# EasyEDA Pro project ProPrj_Joystick_2025-05-01.epro

# Schematic Joystick
Board Name: Joystick; Create Date: 2025-05-01; Page Name: Sheet_1; Project Name: Joystick; Schematic Name: Joystick; Update Date: 2025-05-01; Add into BOM: yes; Company: Your Company; Convert to PCB: yes; Date: 2023-04-02; Draw By: azamtau; REV: 1.0; Sheet: 1/1; spicePre: .
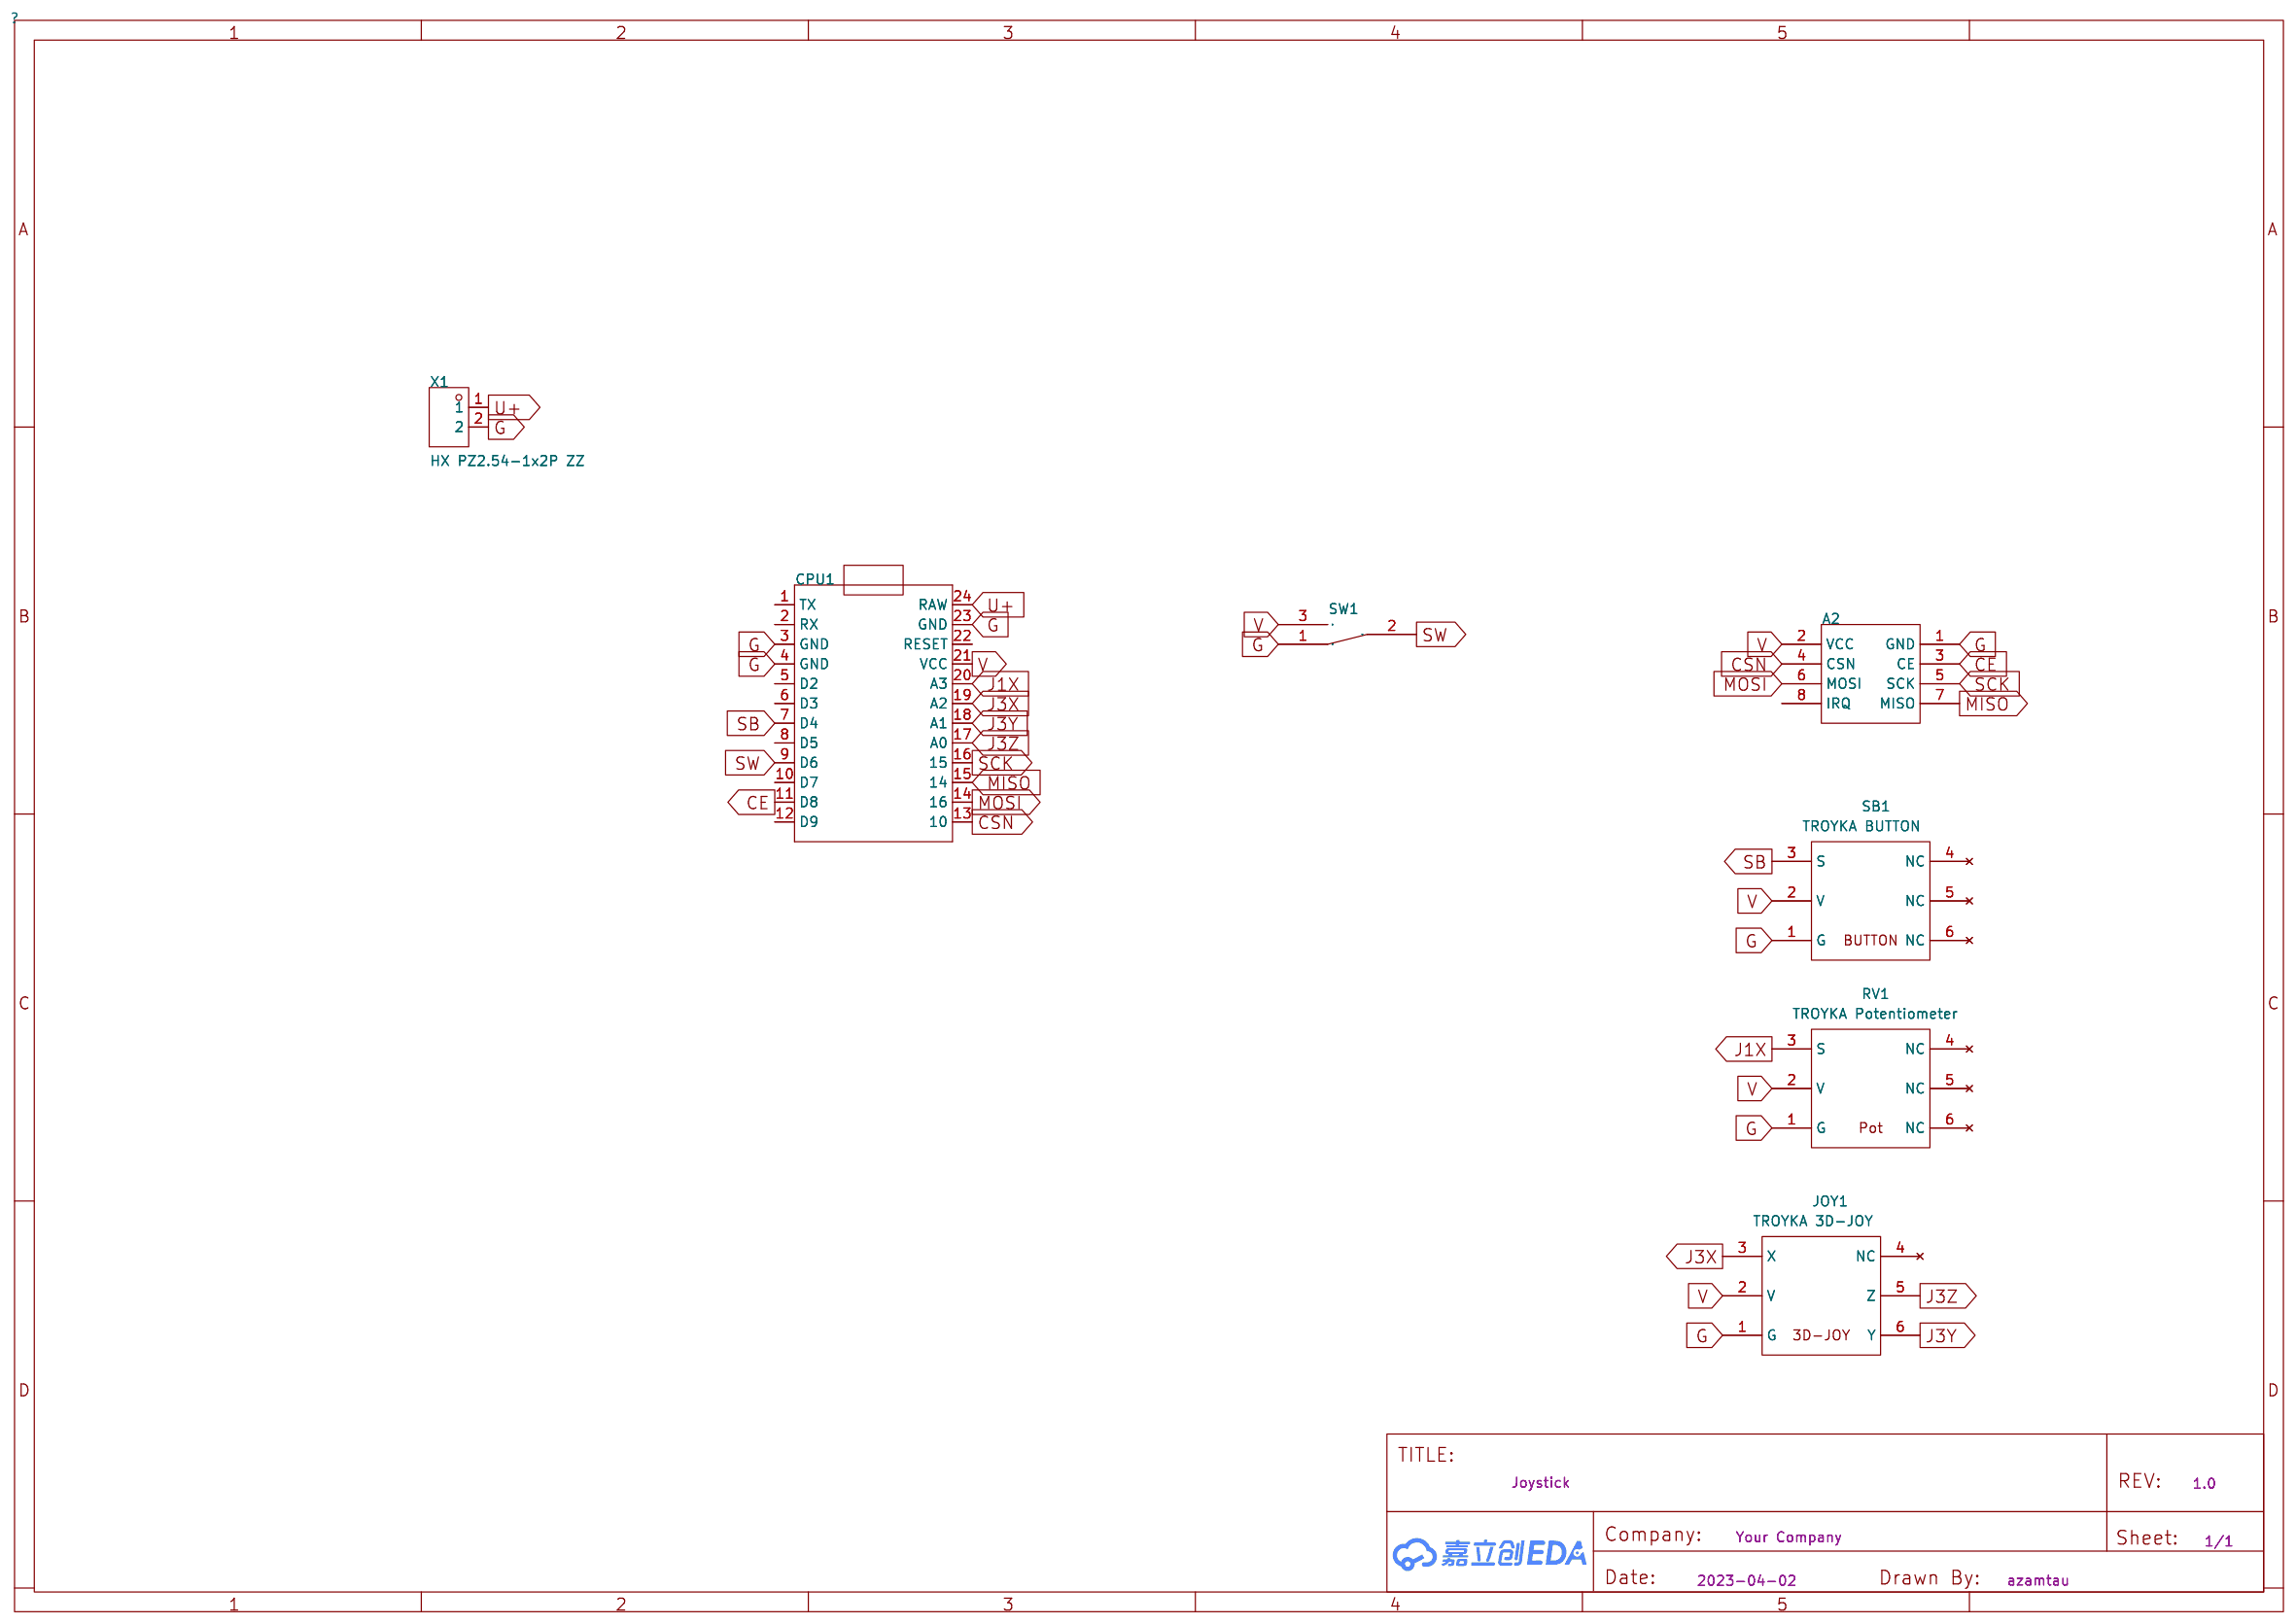
[diagram p0: schematic sheet]

## Parts
A2  -  [MODULE, NRF24L01+]
CPU1  -  [ARDUINOPROMICROUSB]
JOY1  TROYKA 3D-JOY  [TROYKA 3D-JOY]
RV1  TROYKA Potentiometer  [TROYKA Potentiometer]
SB1  TROYKA BUTTON  [TROYKA BUTTON]
SW1  ST-0-102-A01-T000-LF  [SW-TH_3P-L8.3-W5.2-P2.54_ST-0-102-A01-T000]
X1  HX PZ2.54-1x2P ZZ  [HDR-TH_2P-P2.54-V-M-3]

## Library data of the parts
A2 = MODULE, NRF24L01+
CPU1 = Arduino Pro Micro: Arduino Pro Micro с Micro USB (ATmega32U4 5v); NO_CONNECT: yes
JOY1 = TROYKA 3D-JOY
RV1 = TROYKA Potentiometer
SB1 = TROYKA BUTTON
SW1 = ST-0-102-A01-T000-LF: Circuit:Single Pole Double Throw (SPDT) Switch Length:8.3mm Switch Width:5.2mm Switch Height:23.6mm Mechanical Life:- Contact Current:3A Voltage Rating (AC):125V Actuator Type:Cylinder knob Pin Style:Solder Mounting Style:Direct Insert Operating Temperatu; LCSC Part Name: 超小型钮子三脚二档 五件套 含配件; Supplier Part: C1788487; Manufacturer: YUEN FUNG(源丰); Supplier Footprint: 插件; JLCPCB Part Class: Extended Part; Datasheet: https://atta.szlcsc.com/upload/public/pdf/source/20230720/31DDFEC61AC21D005BE18E754C3E93F0.pdf; Supplier: LCSC; Circuit: Single Pole Double Throw (SPDT); Switch Length: 8.3mm; Switch Width: 5.2mm; Switch Height: 23.6mm; Contact Current: 3A; Voltage Rating (AC): 125V; Actuator Type: Cylinder knob; Pin Style: Solder; Mounting Style: Direct Insert; Operating Temperature: -25℃~+85℃
X1 = HX PZ2.54-1x2P ZZ: Pin Structure:1x2P Pitch:2.54mm Row Spacing:- Circluar Pins/Square Pins:Policy Mounting Type:Straight Number of Rows:Single Row Number of Pins:2P Current Rating:3A Voltage Rating (Max):- Length of Mating Pin:6mm Insulation Height:2.5mm Length of End Conne; LCSC Part Name: 1x2P 间距:2.54mm 方针 直插; Supplier Part: C32713268; Manufacturer: hanxia(韩下); Supplier Footprint: 插件,P=2.54mm; JLCPCB Part Class: Extended Part; Datasheet: https://atta.szlcsc.com/upload/public/pdf/source/20240723/BA527AFD31224C91BCCA61696687E4B6.pdf; Supplier: LCSC; Pin Structure: 1x2P; Pitch: 2.54mm; Circluar Pins/Square Pins: Policy; Mounting Type: Straight; Number of Rows: Single Row; Number of Pins: 2P; Current Rating: 3A; Length of Mating Pin: 6mm; Insulation Height: 2.5mm; Length of End Connection Pin: 3mm; Contact Material: Brass; Contact Plating: Gold; Operating Temperature: -40℃~+105℃; Color: Black

## Nets
CE: A2.3(CE) CPU1.11(D8)
CSN: A2.4(CSN) CPU1.13(10)
G: A2.1(GND) CPU1.3(GND) CPU1.4(GND) CPU1.23(GND) JOY1.1(G) RV1.1(G) SB1.1(G) SW1.1 X1.2
J1X: CPU1.20(A3) RV1.3(S)
J3X: CPU1.19(A2) JOY1.3(X)
J3Y: CPU1.18(A1) JOY1.6(Y)
J3Z: CPU1.17(A0) JOY1.5(Z)
MISO: A2.7(MISO) CPU1.15(14)
MOSI: A2.6(MOSI) CPU1.14(16)
SB: CPU1.7(D4) SB1.3(S)
SCK: A2.5(SCK) CPU1.16(15)
SW: CPU1.9(D6) SW1.2
U+: CPU1.24(RAW) X1.1
V: A2.2(VCC) CPU1.21(VCC) JOY1.2(V) RV1.2(V) SB1.2(V) SW1.3

Not connected (* = marked no-connect by the designer): A2 8(IRQ); CPU1 1(TX) 2(RX) 5(D2) 6(D3) 8(D5) 10(D7) 12(D9) 22(RESET); JOY1 4(NC); RV1 4(NC) 5(NC) 6(NC); SB1 4(NC) 5(NC) 6(NC)

# Board PCB_Joystick
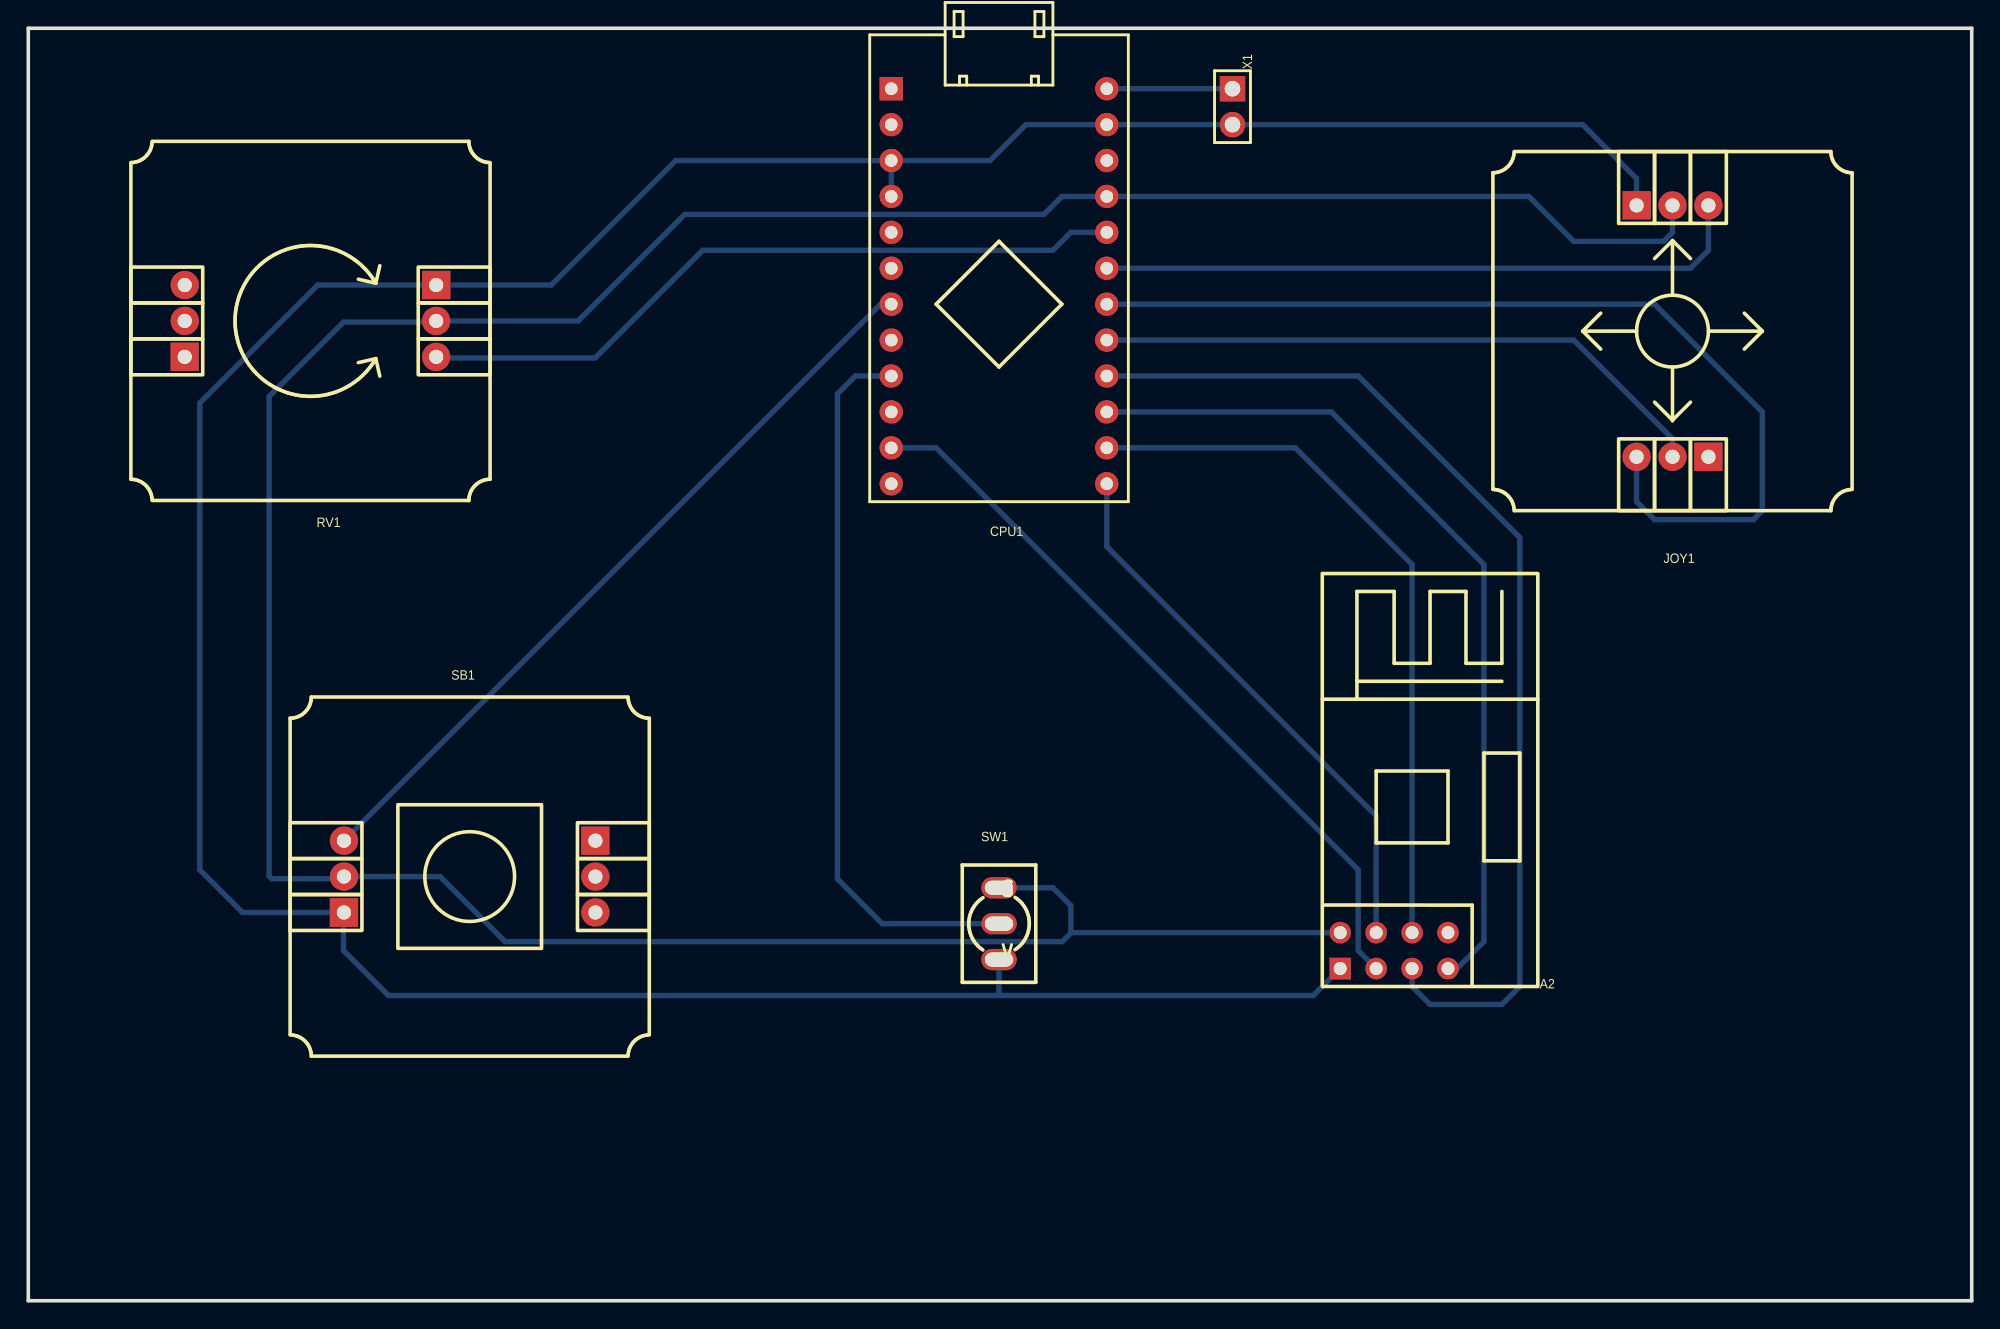
[diagram p1: board, top side]
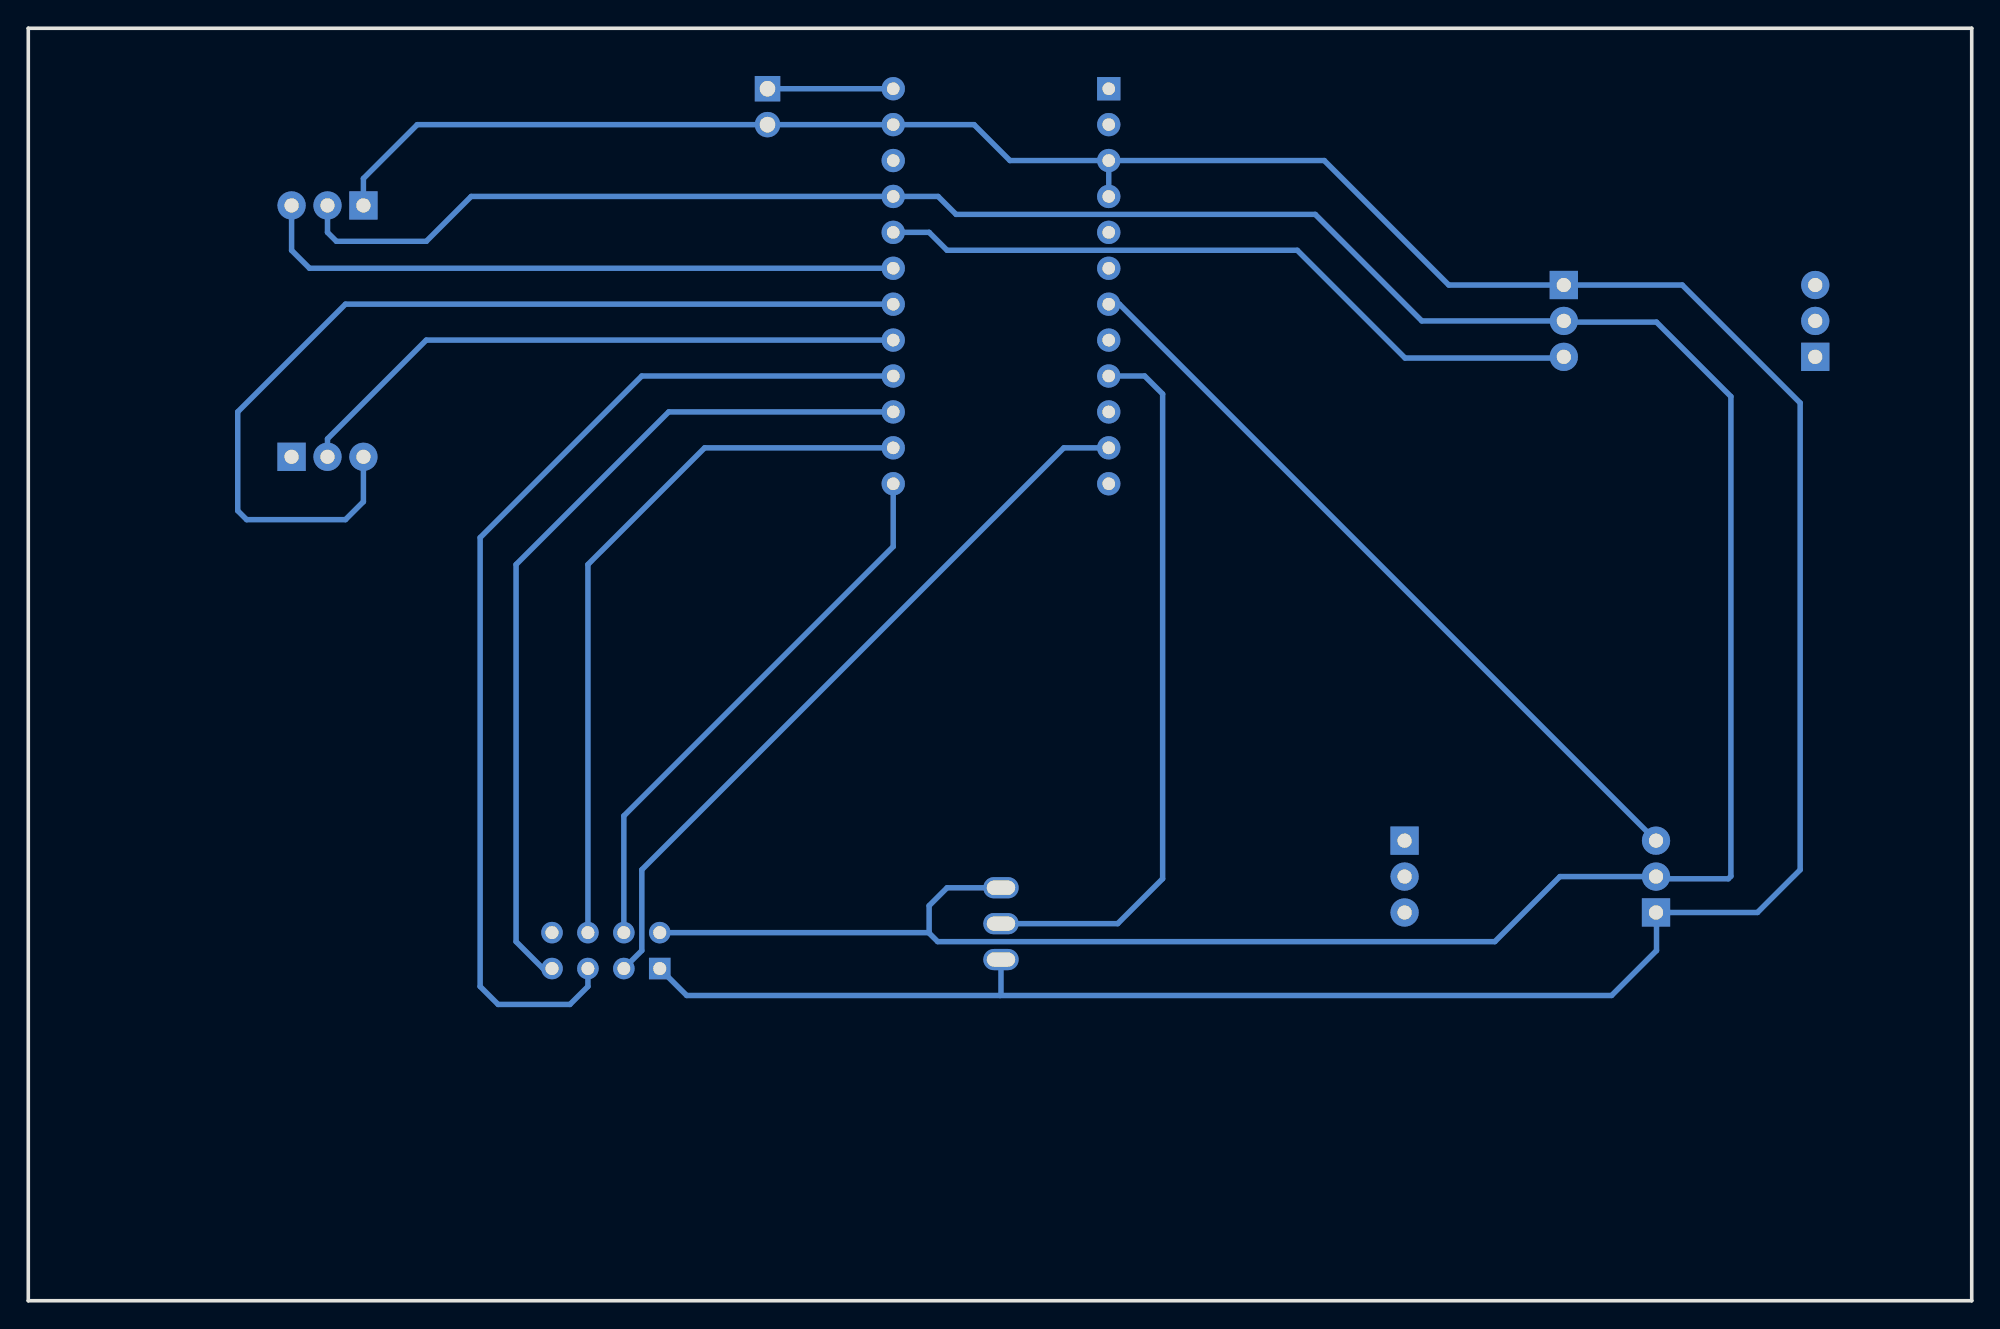
[diagram p2: board, bottom side, seen from below]

Outline 137.43 x 90 mm; copper layers: Top Layer, Bottom Layer. Coordinates in mm from the lower left corner of the outline.
Outline path: 0,90 0,0 137.43,0 137.43,90 0,90
Stack: Top Layer 0.035mm / Dielectric1 1.51mm FR4 er 4.5 / Bottom Layer 0.035mm

## Design rules (mm)
spacing safeClearance (default): track to track 0.152, other pairs 0.152 to 0.3
track width trackWidth (default): min 0.127, default 0.254, max 2.54
differential pair differentialPair (default): width min 0.127, default 0.254, max 2.54; gap min 0.152, default 0.152
via viaSize (default): diameter min 0.5, default 0.61, max 10; hole min 0.3, default 0.305, max 6

## Placement (name value [footprint] x y rotation side)
A2  -  [MODULE, NRF24L01+]  92.77 23.5 180 top
CPU1  -  [ARDUINOPROMICROUSB]  68.64 73.03 0 top
JOY1  -  [TROYKA 3D-JOY]  116.27 68.58 180 top
RV1  -  [TROYKA Potentiometer]  19.95 69.3 90 top
SB1  -  [TROYKA BUTTON]  31.21 30 270 top
SW1  ST-0-102-A01-T000-LF  [SW-TH_3P-L8.3-W5.2-P2.54_ST-0-102-A01-T000]  68.64 26.67 90 top
X1  HX PZ2.54-1x2P ZZ  [HDR-TH_2P-P2.54-V-M-3]  85.15 84.46 270 top

## Footprints (pads in the part's own frame, mm; a bottom-side part is the same pattern mirrored in y, then rotated)
ARDUINOPROMICROUSB
  rect 1.651x1.651 hole 0.889: 1(-7.62,12.7)
  round 1.651 hole 0.889: 2(-7.62,10.16) 3(-7.62,7.62) 4(-7.62,5.08) 5(-7.62,2.54) 6(-7.62,0) 7(-7.62,-2.54) 8(-7.62,-5.08) 9(-7.62,-7.62) 10(-7.62,-10.16) 11(-7.62,-12.7) 12(-7.62,-15.24) 13(7.62,-15.24) 14(7.62,-12.7) 15(7.62,-10.16) 16(7.62,-7.62) 17(7.62,-5.08) 18(7.62,-2.54) 19(7.62,0) 20(7.62,2.54) 21(7.62,5.08) 22(7.62,7.62) 23(7.62,10.16) 24(7.62,12.7)
HDR-TH_2P-P2.54-V-M-3
  rect 1.8x1.8 hole 1.1: 1(-1.27,0)
  round 1.8 hole 1.1: 2(1.27,0)
MODULE, NRF24L01+
  rect 1.524x1.524 hole 0.914: 1(0,0)
  round 1.524 hole 0.914: 2(0,-2.54) 3(-2.54,0) 4(-2.54,-2.54) 5(-5.08,0) 6(-5.08,-2.54) 7(-7.62,0) 8(-7.62,-2.54)
SW-TH_3P-L8.3-W5.2-P2.54_ST-0-102-A01-T000
  oval 1.5x2.5 hole 1x2: 1(-2.54,0) 2(0,0) 3(2.54,0)
TROYKA 3D-JOY
  rect 2x2 hole 1: 1(2.54,-8.89) 4(-2.54,8.89)
  round 2 hole 1: 2(0,-8.889) 3(-2.54,-8.89) 5(0,8.89) 6(2.54,8.89)
TROYKA BUTTON
  rect 2x2 hole 1: 1(2.54,-8.89) 4(-2.54,8.89)
  round 2 hole 1: 2(0,-8.889) 3(-2.54,-8.89) 5(0,8.89) 6(2.54,8.89)
TROYKA Potentiometer
  rect 2x2 hole 1: 1(2.54,-8.89) 4(-2.54,8.89)
  round 2 hole 1: 2(0,-8.889) 3(-2.54,-8.89) 5(0,8.89) 6(2.54,8.89)

## Nets
As in the schematic.

Pads without a net: A2 8; CPU1 1 2 5 6 8 10 12 22; JOY1 4; RV1 4 5 6; SB1 4 5 6

## Routing (per net, layer and track width the routed paths; a pad name or vN(x,y) marks a point on that pad's centre or on a via; arc(x,y) is an arc through that point)
CE: length 52.9
  Bottom Layer w0.381: A2.3 94.04,24.77 94.04,30.48 64.2,60.33 CPU1.11
CSN: length 39.6
  Bottom Layer w0.381: CPU1.13 76.26,53.34 95.31,34.29 A2.4
G: length 238.1
  Bottom Layer w0.381: CPU1.3 68.01,80.65 70.55,83.19 CPU1.23 X1.2 109.92,83.19 113.73,79.38 JOY1.1 ; CPU1.3 CPU1.4 ; CPU1.3 45.78,80.65 36.98,71.84 RV1.1 20.47,71.84 12.13,63.5 12.13,30.48 15.15,27.46 SB1.1 22.29,27.43 22.29,24.77 25.46,21.59 68.71,21.59 ; 68.71,21.59 90.87,21.59 A2.1 ; 68.71,21.59 68.64,21.65 SW1.1
J1X: length 51.1
  Bottom Layer w0.381: CPU1.20 73.72,75.57 72.45,74.3 47.69,74.3 40.07,66.68 28.93,66.68 RV1.3
J3X: length 46.2
  Bottom Layer w0.381: CPU1.19 117.54,73.03 118.81,74.3 JOY1.3
J3Y: length 69.4
  Bottom Layer w0.381: JOY1.6 113.73,56.52 115,55.25 121.98,55.25 122.62,55.88 122.62,62.87 115,70.49 CPU1.18
J3Z: length 44.2
  Bottom Layer w0.381: CPU1.17 109.28,67.95 116.27,60.96 JOY1.5
MISO: length 61.1
  Bottom Layer w0.381: CPU1.15 92.14,62.87 102.93,52.07 102.93,25.4 101.03,23.5 A2.7
MOSI: length 51
  Bottom Layer w0.381: CPU1.14 89.6,60.33 97.85,52.07 A2.6
SB: length 54.4
  Bottom Layer w0.381: CPU1.7 60.27,70.49 SB1.3
SCK: length 75.6
  Bottom Layer w0.381: CPU1.16 94.04,65.41 105.47,53.98 105.47,22.23 104.2,20.96 99.12,20.96 97.85,22.23 A2.5
SW: length 51.4
  Bottom Layer w0.381: CPU1.9 58.48,65.41 57.21,64.14 57.21,29.85 60.39,26.67 SW1.2
U+: length 8.9
  Bottom Layer w0.381: CPU1.24 X1.1
V: length 228.1
  Bottom Layer w0.381: SW1.3 72.45,29.21 73.72,27.94 73.72,26.07 73.76,26.04 ; 73.76,26.04 A2.2 ; 73.76,26.04 73.12,25.4 33.72,25.4 29.12,30 SB1.2 22.17,29.85 17.21,29.85 17.03,30.02 17.03,63.96 22.29,69.22 28.76,69.22 RV1.2 38.89,69.3 46.42,76.84 71.82,76.84 73.09,78.11 CPU1.21 106.11,78.11 109.28,74.93 115.63,74.93 116.27,75.57 JOY1.2

## Text on the board
Top Silkscreen Layer: S | V
